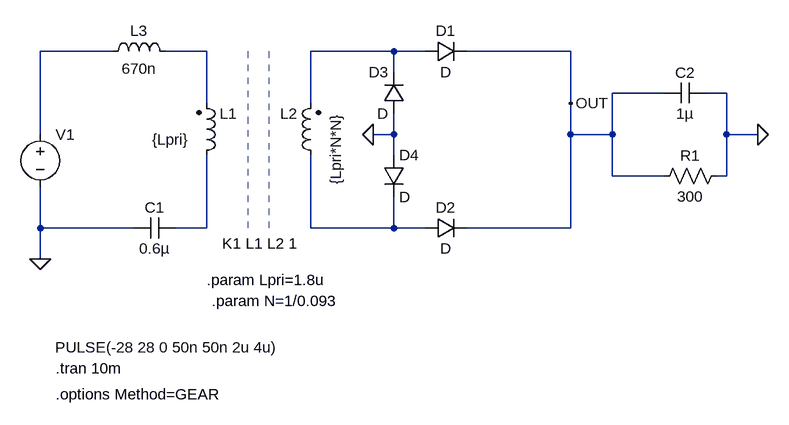
[diagram p0: schematic LLC.asc]
LLC.asc, the LTspice schematic file:
Version 4
SHEET 1 1028 680
WIRE 16 0 -96 0
WIRE 160 0 96 0
WIRE 448 0 320 0
WIRE 496 0 448 0
WIRE 720 0 560 0
WIRE 448 32 448 0
WIRE 864 64 784 64
WIRE 960 64 928 64
WIRE 160 80 160 0
WIRE 320 80 320 0
WIRE 720 80 720 0
WIRE -96 128 -96 0
WIRE 448 128 448 96
WIRE 448 128 416 128
WIRE 720 128 720 80
WIRE 784 128 784 64
WIRE 784 128 720 128
WIRE 960 128 960 64
WIRE 1008 128 960 128
WIRE 448 160 448 128
WIRE 784 192 784 128
WIRE 864 192 784 192
WIRE 960 192 960 128
WIRE 960 192 944 192
WIRE -96 272 -96 208
WIRE 48 272 -96 272
WIRE 160 272 160 160
WIRE 160 272 112 272
WIRE 320 272 320 160
WIRE 448 272 448 224
WIRE 448 272 320 272
WIRE 496 272 448 272
WIRE 720 272 720 128
WIRE 720 272 560 272
WIRE -96 320 -96 272
FLAG 416 128 0
FLAG -96 320 0
FLAG 720 80 OUT
FLAG 1008 128 0
SYMBOL cap 112 256 R90
WINDOW 0 0 32 VBottom 2
WINDOW 3 32 32 VTop 2
SYMATTR InstName C1
SYMATTR Value 0.6µ
SYMBOL ind2 144 176 M180
WINDOW 0 36 80 Left 2
WINDOW 3 -68 40 Left 2
SYMATTR InstName L1
SYMATTR Value {Lpri}
SYMATTR Type ind
SYMBOL ind2 336 176 R180
WINDOW 0 36 80 Left 2
WINDOW 3 -23 -29 VRight 2
SYMATTR InstName L2
SYMATTR Value {Lpri*N*N}
SYMATTR Type ind
SYMBOL ind 0 16 R270
WINDOW 0 32 56 VTop 2
WINDOW 3 5 56 VBottom 2
SYMATTR InstName L3
SYMATTR Value 670n
SYMBOL diode 496 16 R270
WINDOW 0 32 32 VTop 2
WINDOW 3 0 32 VBottom 2
SYMATTR InstName D1
SYMBOL diode 496 288 R270
WINDOW 0 32 32 VTop 2
WINDOW 3 0 32 VBottom 2
SYMATTR InstName D2
SYMBOL diode 464 96 R180
WINDOW 0 24 64 Left 2
WINDOW 3 24 0 Left 2
SYMATTR InstName D3
SYMBOL diode 432 160 R0
SYMATTR InstName D4
SYMBOL cap 928 48 R90
WINDOW 0 0 32 VBottom 2
WINDOW 3 32 32 VTop 2
SYMATTR InstName C2
SYMATTR Value 1µ
SYMBOL res 960 176 R90
WINDOW 0 0 56 VBottom 2
WINDOW 3 32 56 VTop 2
SYMATTR InstName R1
SYMATTR Value 300
SYMBOL voltage -96 112 R0
WINDOW 3 23 344 Left 2
WINDOW 123 0 0 Left 0
WINDOW 39 0 0 Left 0
SYMATTR Value PULSE(-28 28 0 50n 50n 2u 4u)
SYMATTR InstName V1
TEXT 168 384 Left 2 !.param N=1/0.093
TEXT 160 352 Left 2 !.param Lpri=1.8u
TEXT -72 488 Left 2 !.tran 10m
TEXT 184 296 Left 2 !K1 L1 L2 1
TEXT -72 528 Left 2 !.options Method=GEAR
LINE Normal 224 272 224 0 2
LINE Normal 224 272 224 272 2
LINE Normal 256 272 256 0 2

The netlist it stands for:
* LLC.asc
C1 N004 0 0.6µ
L1 N004 N002 {Lpri}
L2 N005 N003 {Lpri*N*N}
L3 N001 N002 670n
D1 N003 OUT D
D2 N005 OUT D
D3 0 N003 D
D4 0 N005 D
C2 0 OUT 1µ
R1 0 OUT 300
V1 N001 0 PULSE(-28 28 0 50n 50n 2u 4u)
.model D D
.lib standard.dio
.param N=1/0.093
.param Lpri=1.8u
.tran 10m
K1 L1 L2 1
.options Method=GEAR
.backanno
.end